# Altium schematic sheet clock.SchDoc
size A4
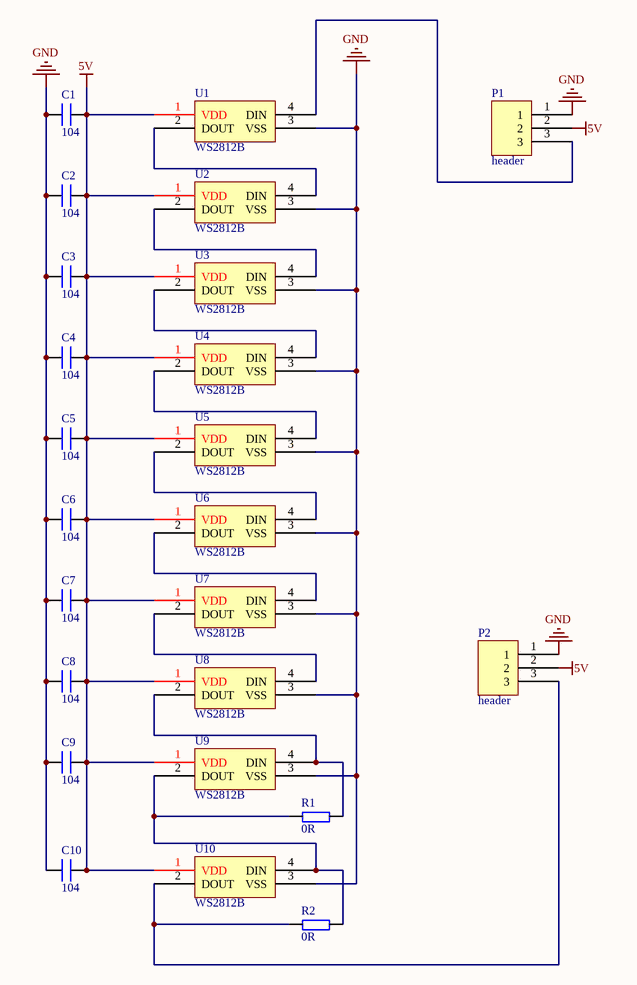
[diagram p0: clock.SchDoc]

## Parts
C1  104  [0603P]
C2  104  [0603P]
C3  104  [0603P]
C4  104  [0603P]
C5  104  [0603P]
C6  104  [0603P]
C7  104  [0603P]
C8  104  [0603P]
C9  104  [0603P]
C10  104  [0603P]
P1  header  [HEADWR3-1]
P2  header  [HEADWR3-1]
R1  0R  [0603P]
R2  0R  [0603P]
U1  WS2812B  [ws2812b]
U2  WS2812B  [ws2812b]
U3  WS2812B  [ws2812b]
U4  WS2812B  [ws2812b]
U5  WS2812B  [ws2812b]
U6  WS2812B  [ws2812b]
U7  WS2812B  [ws2812b]
U8  WS2812B  [ws2812b]
U9  WS2812B  [ws2812b]
U10  WS2812B  [ws2812b]

## Nets
5V: C1.2 C2.2 C3.2 C4.2 C5.2 C6.2 C7.2 C8.2 C9.2 C10.2 P1.2 P2.2 U1.1(VDD) U2.1(VDD) U3.1(VDD) U4.1(VDD) U5.1(VDD) U6.1(VDD) U7.1(VDD) U8.1(VDD) U9.1(VDD) U10.1(VDD)
GND: C1.1 C2.1 C3.1 C4.1 C5.1 C6.1 C7.1 C8.1 C9.1 C10.1 P1.1 P2.1 U1.3(VSS) U2.3(VSS) U3.3(VSS) U4.3(VSS) U5.3(VSS) U6.3(VSS) U7.3(VSS) U8.3(VSS) U9.3(VSS) U10.3(VSS)
NetP1_3: P1.3 U1.4(DIN)
NetP2_3: P2.3 R2.1 U10.2(DOUT)
NetR1_1: R1.1 R2.2 U9.2(DOUT) U10.4(DIN)
NetR1_2: R1.2 U8.2(DOUT) U9.4(DIN)
NetU1_2: U1.2(DOUT) U2.4(DIN)
NetU2_2: U2.2(DOUT) U3.4(DIN)
NetU3_2: U3.2(DOUT) U4.4(DIN)
NetU4_2: U4.2(DOUT) U5.4(DIN)
NetU5_2: U5.2(DOUT) U6.4(DIN)
NetU6_2: U6.2(DOUT) U7.4(DIN)
NetU7_2: U7.2(DOUT) U8.4(DIN)

## Library data of the parts
C1-C10 = C
P1 P2 = header3
R1 R2 = R